# EAGLE design 1-WireHumidity (EAGLE 6.5.0)
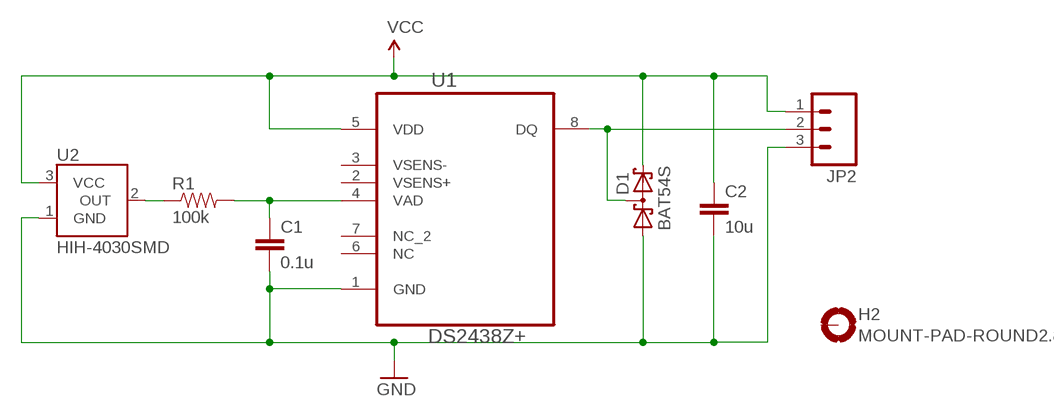
[diagram p0: schematic, sheet 1]

## Parts
C1  0.1u  CAP0603-CAP  [0603-CAP]
C2  10u  CAP0603-CAP  [0603-CAP]
D1  BAT54S  [SOT23]
H2  MOUNT-PAD-ROUND2.8  [2,8-PAD]
JP2  M03LONGPADS  [1X03_LONGPADS]
R1  100k  RESISTOR0603-RES  [0603-RES]
U1  DS2438Z+  [SOIC127P600X175-8N]
U2  HIH-4030SMD  [HIH-4030]

## Nets
GND: C1.2 C2.2 D1.1(A1) JP2.3 U1.1(GND) U2.1(GND)
N$1: R1.1 U2.2(OUT)
QD: D1.3(C1A2) JP2.2 U1.8(DQ)
VAD: C1.1 R1.2 U1.4(VAD)
VCC: C2.1 D1.2(C2) JP2.1 U1.5(VDD) U2.3(VCC)
Unconnected: H2.B2,8(MOUNT) U1.2(VSENS+) U1.3(VSENS-) U1.6(NC) U1.7(NC_2)

## Library data of the parts
C1 C2 = SparkFun-Capacitors:CAP: Capacitor Standard 0603 ceramic capacitor, and 0.1" leaded capacitor.
D1 = diode:BAT54S: Schottky Diodes Pin connection corrected 2011-05-04 Source: Fairchild .. BAT54.pdf
H2 = holes:MOUNT-PAD-ROUND: MOUNTING PAD, round
JP2 = SparkFun-Connectors:M03: Header 3 Standard 3-pin 0.1" header. Use with straight break away headers (SKU : PRT-00116), right angle break away headers (PRT-00553), swiss pins (PRT-00743), machine pins (PRT-00117), and female headers (PRT-00115). Molex polarized connector foot print use with SKU : PRT-08232 with associated crimp pins and housings.
R1 = SparkFun-Resistors:RESISTOR: Resistor Basic schematic elements and footprints for 0603, 1206, and PTH resistors.
U1 = Maxim-DS2438Z:DS2438Z+: Smart Battery Monitor; MPN: DS2438Z+; OC_FARNELL: 1455593; OC_NEWARK: 27K7484; PACKAGE: SOIC-8; SUPPLIER: Maxim
U2 = SparkFun-Sensors:HIH-4030: Humidity Sensor

## Board
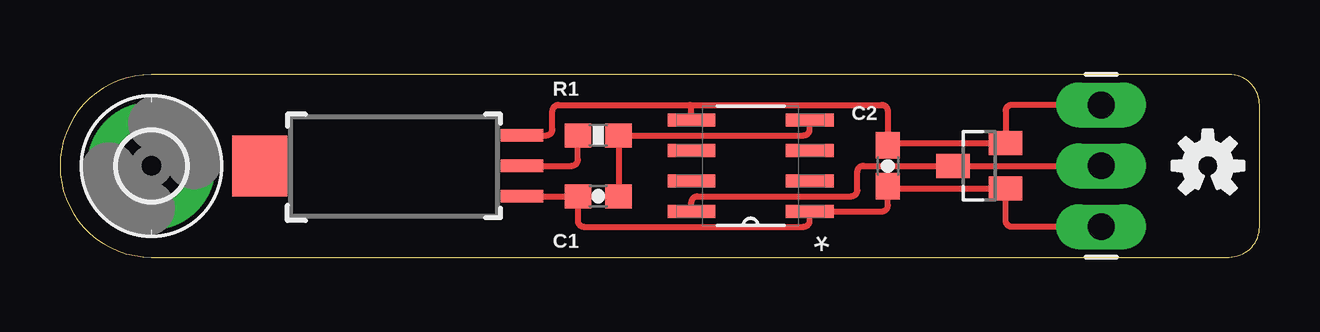
[diagram p1: board, top side]
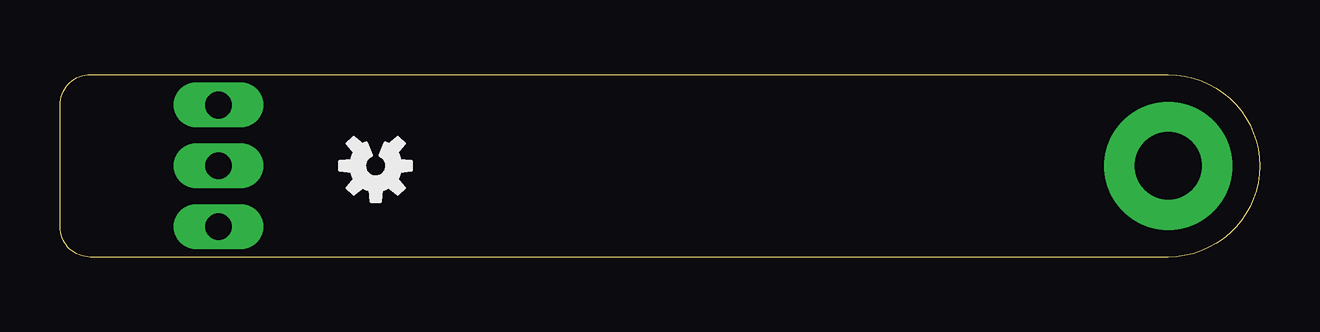
[diagram p2: board, bottom side, seen from below]

Size 49.98 x 7.62 mm. Coordinates in mm from the lower left corner, seen from the top.
Outline: 48.71,7.62 3.81,7.62 arc90 0,3.81 arc90 3.81,0 48.71,0 arc90 49.98,1.27 49.98,6.35 arc90 48.71,7.62
Copper layers (1*16): Top 0.035mm / dielectric 1.5mm / Bottom 0.035mm
Design rules "ITEADstudio_DRC": minimum track width 6mil, minimum drill 12mil, track to track 6mil, track to pad 6mil, pad to pad 6mil, via to via 6mil, smd to smd 0mil, copper to edge 10mil, drill to drill 10mil, minimum pad ring 10mil, minimum via ring 6mil, stop-mask expansion 2mil, vias tented up to drill 100mil, thermal gap 10mil

### Footprints (pad centres in the part's own frame; a part is rotated, then mirrored left to right if it is on the bottom)
0603-CAP = smd 1.1 x 1: 1 -0.85,0; 2 0.85,0
SOT23 = smd 1 x 1.4: 1 -0.95,-1.1; 2 0.95,-1.1; 3 0,1.1
2,8-PAD = drill 2.8 pad 5.334: B2,8 0,0
1X03_LONGPADS = drill 1.118 pad 1.88 long: 1 0,0; 2 2.54,0; 3 5.08,0
0603-RES = smd 1.1 x 1: 1 -0.85,0; 2 0.85,0
SOIC127P600X175-8N = smd 1.981 x 0.533: 1 -2.464,1.905; 2 -2.464,0.635; 3 -2.464,-0.635; 4 -2.464,-1.905; 5 2.464,-1.905; 6 2.464,-0.635; 7 2.464,0.635; 8 2.464,1.905
HIH-4030 = smd 0.508 x 1.778: 1 -1.27,-5.08; 2 0,-5.08; 3 1.27,-5.08 | smd 2.54 x 2.286: NC 0,5.842

### Placement (x,y rotation side)
C1  22.43,2.54 180 top
C2  34.49,3.81 270 top
D1  38.3,3.81 90 top
H2  3.81,3.81 0 top
JP2  43.38,6.35 270 top
R1  22.43,5.08 0 top
U1  28.77,3.81 180 top
U2  14.17,3.81 90 top
U$1  [OSHW-LOGO-S]  47.83,3.81 0 top
U$3  [OSHW-LOGO-S]  36.83,3.81 180 bottom

### Tracks (layer width: path | path; a pad name or v marks a point on that pad's centre or on a via)
GND
  Top 0.254: U2.1 C1.2 21.57,1.52 arc90 21.83,1.27 30.98,1.27 arc90 31.24,1.52 U1.1 34.24,1.91 arc90 34.49,2.16 C2.2 34.52,2.93 arc45 34.7,2.86 D1.1 | D1.1 39.65,2.61 arc45 39.83,2.54 | JP2.3 39.65,1.27 arc-90 39.4,1.52 D1.1
N$1
  Top 0.254: U2.2 21.32,3.81 arc90 21.57,4.06 R1.1
QD
  Top 0.254: U1.8 26.31,2.29 arc-90 26.57,2.54 32.97,2.54 arc90 33.22,2.79 33.22,3.56 arc-90 33.47,3.81 D1.3 JP2.2
VAD
  Top 0.254: C1.1 R1.2 30.98,5.08 arc90 31.24,5.33 U1.4
VCC
  Top 0.254: U2.3 20.27,5.08 arc90 20.52,5.33 20.52,6.1 arc-90 20.77,6.35 26.23,6.35 | 26.23,6.35 34.24,6.35 arc-90 34.49,6.1 C2.1 34.52,4.69 arc-45 34.7,4.76 D1.2 39.4,6.1 arc-90 39.65,6.35 JP2.1 | U1.5 26.31,6.27 arc90 26.23,6.35

### Text on the board
tValues: VCC | OW | GND
bValues: VCC | taaralabs.eu/oh1 | OW | GND